# Altium schematic sheet TOP.SchDoc
size B
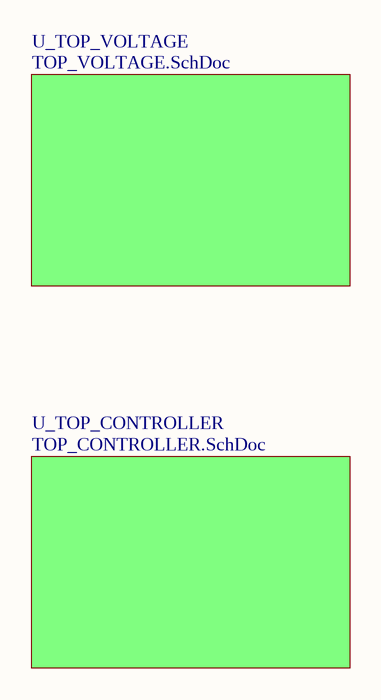
[diagram p0: TOP.SchDoc]

## Sub-sheets
U_TOP_CONTROLLER = TOP_CONTROLLER.SchDoc: no entries
U_TOP_VOLTAGE = TOP_VOLTAGE.SchDoc: no entries